# Altium schematic sheet SampleAndHold.SchDoc
size A4
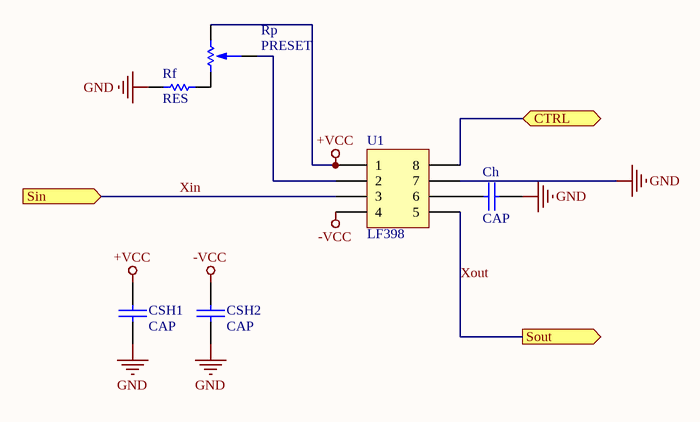
[diagram p0: SampleAndHold.SchDoc]

## Parts
Ch  CAP  [CAP200]
CSH1  CAP  [CAP200]
CSH2  CAP  [CAP200]
Rf  RES  [RES400]
Rp  PRESET  [PRESET V]
U1  LF398  [DIP8]

## Ports
CTRL (bidir), Sin (in), Sout (out)

## Nets
+VCC: CSH1.1 Rp.1 U1.1
-VCC: CSH2.1 U1.4
GND: Ch.2 CSH1.2 CSH2.2 Rf.1 U1.7
CTRL: U1.8 ; port CTRL
Xin: U1.3 ; port Sin
Xout: U1.5 ; port Sout
NetCh_1: Ch.1 U1.6
NetRf_2: Rf.2 Rp.3
NetRp_2: Rp.2 U1.2

## Library data of the parts
U1 = IC_DIP8